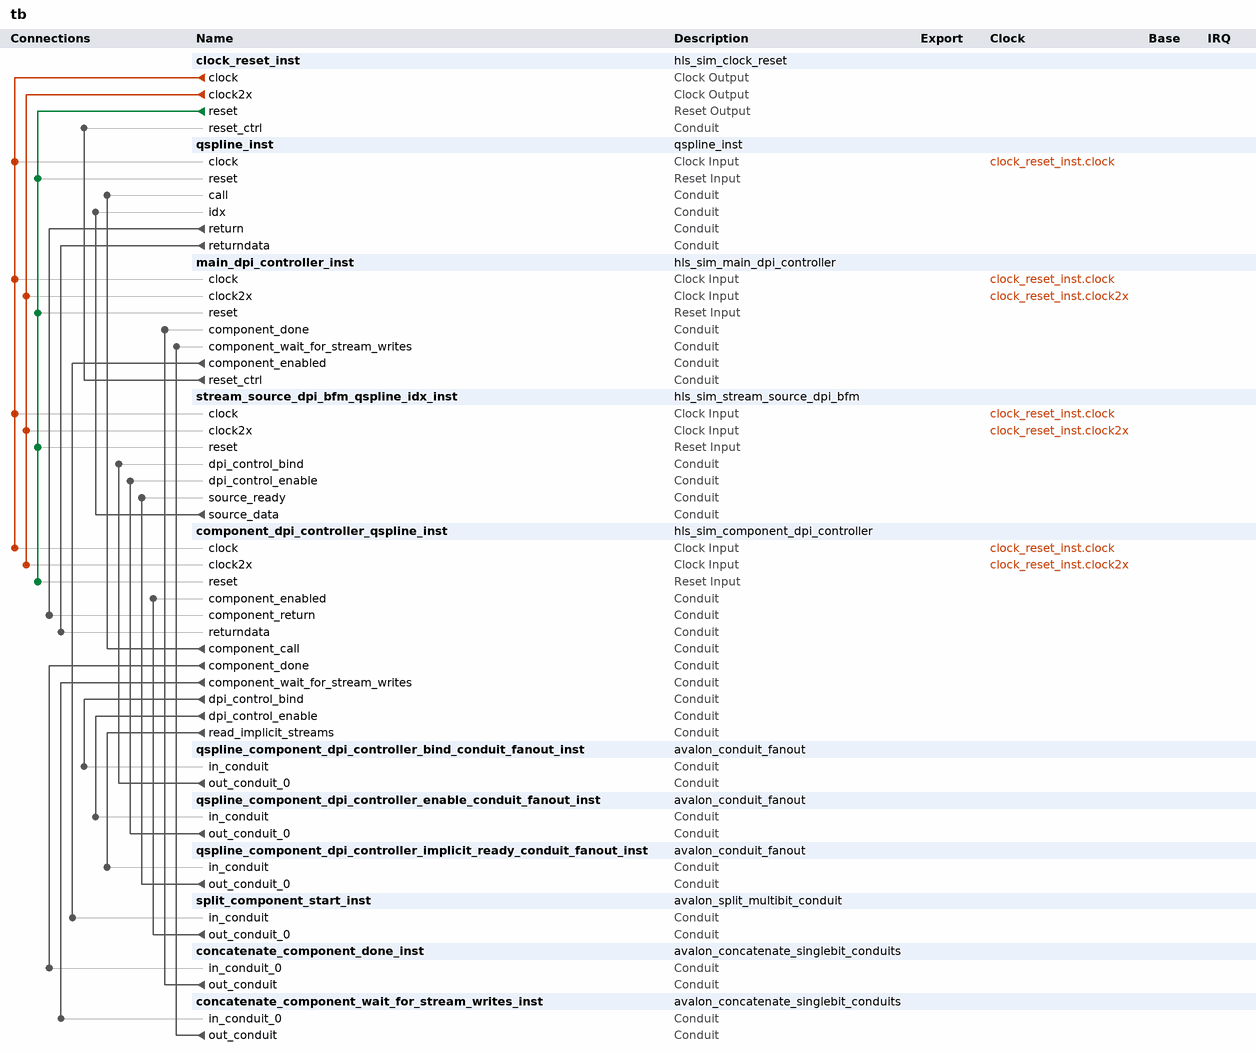
[diagram p0: system contents]
# Platform Designer (Qsys) system tb, Arria 10 10AS016C3U19E2LG
# Parameters at their usual value, and those the tool derives, are not listed.
package require -exact qsys 1.0
create_system tb
set_project_property DEVICE_FAMILY {Arria 10}
set_project_property DEVICE 10AS016C3U19E2LG

add_component clock_reset_inst ip/tb/clock_reset.ip hls_sim_clock_reset clock_reset_inst 1.0

add_component qspline_inst ../components/qspline/qspline.ip qspline_inst qspline_inst 1.0

add_component main_dpi_controller_inst ip/tb/main_dpi_controller.ip hls_sim_main_dpi_controller main_dpi_controller_inst 1.0
load_component main_dpi_controller_inst
set_component_parameter_value NUM_COMPONENTS 1
set_component_parameter_value COMPONENT_NAMES_STR qspline
save_component

add_component stream_source_dpi_bfm_qspline_idx_inst ip/tb/sso_qspline_idx.ip hls_sim_stream_source_dpi_bfm stream_source_dpi_bfm_qspline_idx_inst 1.0
load_component stream_source_dpi_bfm_qspline_idx_inst
set_component_parameter_value COMPONENT_NAME qspline
set_component_parameter_value INTERFACE_NAME idx
set_component_parameter_value STREAM_DATAWIDTH 32
set_component_parameter_value FORCE_STREAM_CONDUIT 1
set_component_parameter_value STREAM_BITSPERSYMBOL 1
set_component_parameter_value USES_PACKETS 0
set_component_parameter_value EMPTY_WIDTH 0
set_component_parameter_value FIRST_SYMBOL_IN_HIGH_ORDER_BITS 0
save_component

add_component component_dpi_controller_qspline_inst ip/tb/dpic_qspline.ip hls_sim_component_dpi_controller component_dpi_controller_qspline_inst 1.0
load_component component_dpi_controller_qspline_inst
set_component_parameter_value COMPONENT_NAME qspline
set_component_parameter_value COMPONENT_MANGLED_NAME _Z7qsplinei
set_component_parameter_value RETURN_DATAWIDTH 32
set_component_parameter_value COMPONENT_NUM_SLAVES 0
set_component_parameter_value COMPONENT_HAS_SLAVE_RETURN 0
set_component_parameter_value COMPONENT_NUM_OUTPUT_STREAMS 0
save_component

add_component qspline_component_dpi_controller_bind_conduit_fanout_inst ip/tb/qspline_cfan.ip avalon_conduit_fanout qspline_component_dpi_controller_bind_conduit_fanout_inst 1.0
load_component qspline_component_dpi_controller_bind_conduit_fanout_inst
set_component_parameter_value numFanOut 1
save_component

add_component qspline_component_dpi_controller_enable_conduit_fanout_inst ip/tb/qspline_en_cfan.ip avalon_conduit_fanout qspline_component_dpi_controller_enable_conduit_fanout_inst 1.0
load_component qspline_component_dpi_controller_enable_conduit_fanout_inst
set_component_parameter_value numFanOut 1
save_component

add_component qspline_component_dpi_controller_implicit_ready_conduit_fanout_inst ip/tb/qspline_ir_cfan.ip avalon_conduit_fanout qspline_component_dpi_controller_implicit_ready_conduit_fanout_inst 1.0
load_component qspline_component_dpi_controller_implicit_ready_conduit_fanout_inst
set_component_parameter_value numFanOut 1
save_component

add_component split_component_start_inst ip/tb/sp_cstart.ip avalon_split_multibit_conduit split_component_start_inst 1.0

add_component concatenate_component_done_inst ip/tb/cat_done.ip avalon_concatenate_singlebit_conduits concatenate_component_done_inst 1.0
load_component concatenate_component_done_inst
set_component_parameter_value multibit_width 1
save_component

add_component concatenate_component_wait_for_stream_writes_inst ip/tb/cat_cwfsw.ip avalon_concatenate_singlebit_conduits concatenate_component_wait_for_stream_writes_inst 1.0

# connections
add_connection clock_reset_inst.clock component_dpi_controller_qspline_inst.clock clock
add_connection clock_reset_inst.clock main_dpi_controller_inst.clock clock
add_connection clock_reset_inst.clock qspline_inst.clock clock
add_connection clock_reset_inst.clock stream_source_dpi_bfm_qspline_idx_inst.clock clock
add_connection clock_reset_inst.clock2x component_dpi_controller_qspline_inst.clock2x clock
add_connection clock_reset_inst.clock2x main_dpi_controller_inst.clock2x clock
add_connection clock_reset_inst.clock2x stream_source_dpi_bfm_qspline_idx_inst.clock2x clock
add_connection clock_reset_inst.reset component_dpi_controller_qspline_inst.reset reset
add_connection clock_reset_inst.reset main_dpi_controller_inst.reset reset
add_connection clock_reset_inst.reset qspline_inst.reset reset
add_connection clock_reset_inst.reset stream_source_dpi_bfm_qspline_idx_inst.reset reset
add_connection component_dpi_controller_qspline_inst.component_call qspline_inst.call conduit
add_connection component_dpi_controller_qspline_inst.component_done concatenate_component_done_inst.in_conduit_0 conduit
add_connection component_dpi_controller_qspline_inst.component_wait_for_stream_writes concatenate_component_wait_for_stream_writes_inst.in_conduit_0 conduit
add_connection component_dpi_controller_qspline_inst.dpi_control_bind qspline_component_dpi_controller_bind_conduit_fanout_inst.in_conduit conduit
add_connection component_dpi_controller_qspline_inst.dpi_control_enable qspline_component_dpi_controller_enable_conduit_fanout_inst.in_conduit conduit
add_connection component_dpi_controller_qspline_inst.read_implicit_streams qspline_component_dpi_controller_implicit_ready_conduit_fanout_inst.in_conduit conduit
add_connection concatenate_component_done_inst.out_conduit main_dpi_controller_inst.component_done conduit
add_connection concatenate_component_wait_for_stream_writes_inst.out_conduit main_dpi_controller_inst.component_wait_for_stream_writes conduit
add_connection main_dpi_controller_inst.component_enabled split_component_start_inst.in_conduit conduit
add_connection main_dpi_controller_inst.reset_ctrl clock_reset_inst.reset_ctrl conduit
add_connection qspline_component_dpi_controller_bind_conduit_fanout_inst.out_conduit_0 stream_source_dpi_bfm_qspline_idx_inst.dpi_control_bind conduit
add_connection qspline_component_dpi_controller_enable_conduit_fanout_inst.out_conduit_0 stream_source_dpi_bfm_qspline_idx_inst.dpi_control_enable conduit
add_connection qspline_component_dpi_controller_implicit_ready_conduit_fanout_inst.out_conduit_0 stream_source_dpi_bfm_qspline_idx_inst.source_ready conduit
add_connection qspline_inst.return component_dpi_controller_qspline_inst.component_return conduit
add_connection qspline_inst.returndata component_dpi_controller_qspline_inst.returndata conduit
add_connection split_component_start_inst.out_conduit_0 component_dpi_controller_qspline_inst.component_enabled conduit
add_connection stream_source_dpi_bfm_qspline_idx_inst.source_data qspline_inst.idx conduit

save_system tb.qsys
